# EAGLE schematic TreeShield (EAGLE 6.4)
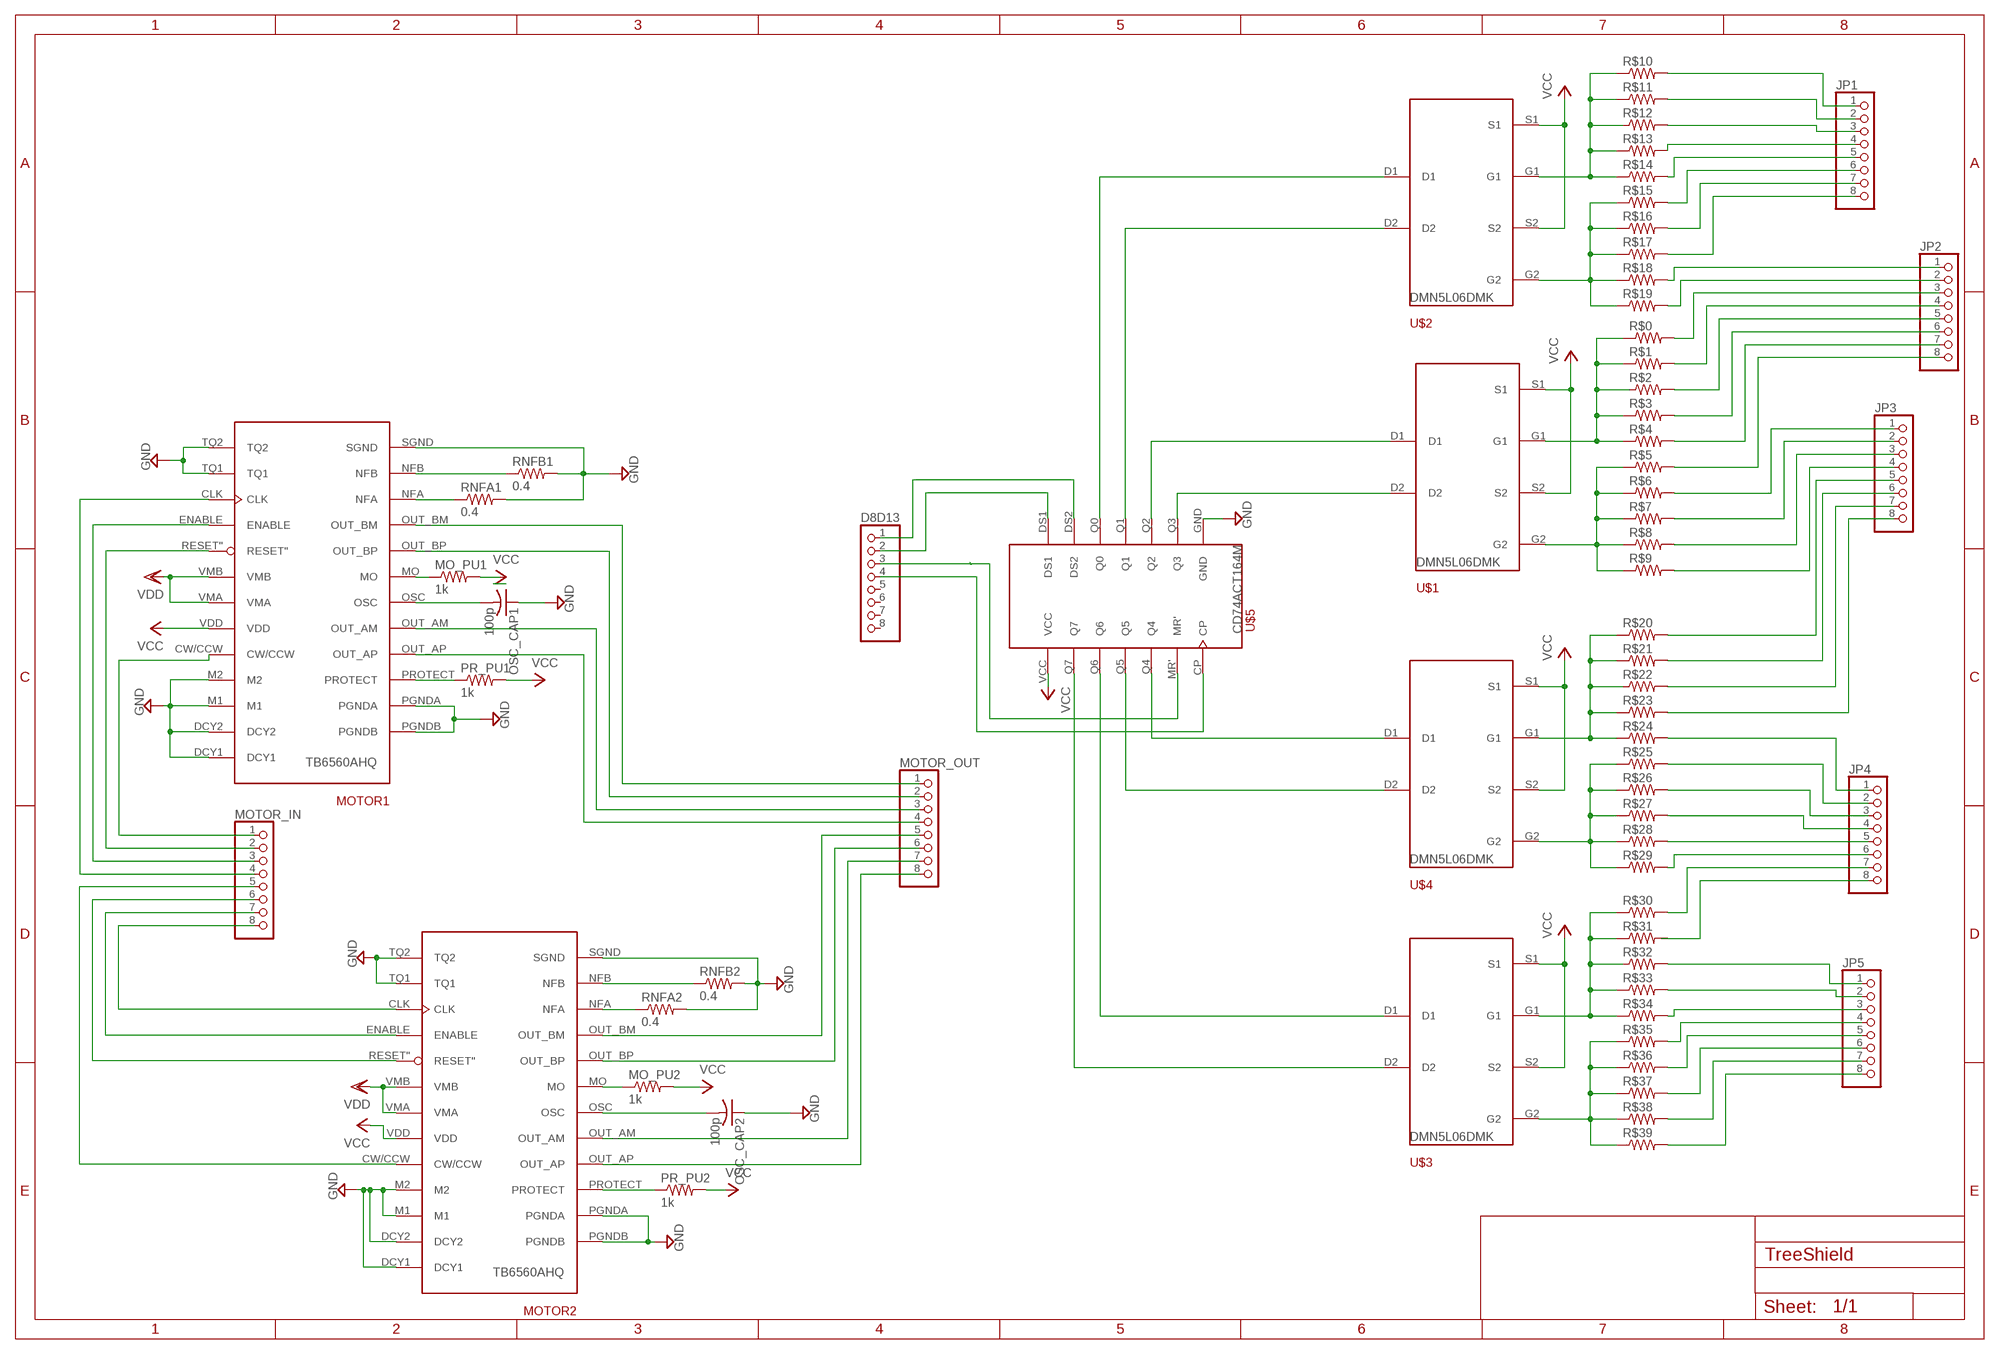
[diagram p0: schematic, sheet 1]

## Parts
D8D13  PINHD-1X8CLEANBIG  [1X08-CLEANBIG]
JP1  PINHD-1X8BIG  [1X08-BIG]
JP2  PINHD-1X8BIG  [1X08-BIG]
JP3  PINHD-1X8BIG  [1X08-BIG]
JP4  PINHD-1X8BIG  [1X08-BIG]
JP5  PINHD-1X8BIG  [1X08-BIG]
MO_PU1  1k  R-US_R0603  [R0603]
MO_PU2  1k  R-US_R0603  [R0603]
MOTOR1  TB6560AHQ  [TB6560AHQ]
MOTOR2  TB6560AHQ  [TB6560AHQ]
MOTOR_IN  PINHD-1X8CLEANBIG  [1X08-CLEANBIG]
MOTOR_OUT  PINHD-1X8CLEANBIG  [1X08-CLEANBIG]
OSC_CAP1  100p  C-USC0603  [C0603]
OSC_CAP2  100p  C-USC0603  [C0603]
PR_PU1  1k  R-US_R0603  [R0603]
PR_PU2  1k  R-US_R0603  [R0603]
R$0  R-US_0817/7V  [P0817V]
R$1  R-US_0817/7V  [P0817V]
R$2  R-US_0817/7V  [P0817V]
R$3  R-US_0817/7V  [P0817V]
R$4  R-US_0817/7V  [P0817V]
R$5  R-US_0817/7V  [P0817V]
R$6  R-US_0817/7V  [P0817V]
R$7  R-US_0817/7V  [P0817V]
R$8  R-US_0817/7V  [P0817V]
R$9  R-US_0817/7V  [P0817V]
R$10  R-US_0817/7V  [P0817V]
R$11  R-US_0817/7V  [P0817V]
R$12  R-US_0817/7V  [P0817V]
R$13  R-US_0817/7V  [P0817V]
R$14  R-US_0817/7V  [P0817V]
R$15  R-US_0817/7V  [P0817V]
R$16  R-US_0817/7V  [P0817V]
R$17  R-US_0817/7V  [P0817V]
R$18  R-US_0817/7V  [P0817V]
R$19  R-US_0817/7V  [P0817V]
R$20  R-US_0817/7V  [P0817V]
R$21  R-US_0817/7V  [P0817V]
R$22  R-US_0817/7V  [P0817V]
R$23  R-US_0817/7V  [P0817V]
R$24  R-US_0817/7V  [P0817V]
R$25  R-US_0817/7V  [P0817V]
R$26  R-US_0817/7V  [P0817V]
R$27  R-US_0817/7V  [P0817V]
R$28  R-US_0817/7V  [P0817V]
R$29  R-US_0817/7V  [P0817V]
R$30  R-US_0817/7V  [P0817V]
R$31  R-US_0817/7V  [P0817V]
R$32  R-US_0817/7V  [P0817V]
R$33  R-US_0817/7V  [P0817V]
R$34  R-US_0817/7V  [P0817V]
R$35  R-US_0817/7V  [P0817V]
R$36  R-US_0817/7V  [P0817V]
R$37  R-US_0817/7V  [P0817V]
R$38  R-US_0817/7V  [P0817V]
R$39  R-US_0817/7V  [P0817V]
RNFA1  0.4  R-US_0817/7V  [P0817V]
RNFA2  0.4  R-US_0817/7V  [P0817V]
RNFB1  0.4  R-US_0817/7V  [P0817V]
RNFB2  0.4  R-US_0817/7V  [P0817V]
U$1  DMN5L06DMK  [DMN5L06DMK]
U$2  DMN5L06DMK  [DMN5L06DMK]
U$3  DMN5L06DMK  [DMN5L06DMK]
U$4  DMN5L06DMK  [DMN5L06DMK]
U$5  CD74ACT164M  [CD74ACT164M]

## Nets
CLK1: MOTOR1.CLK MOTOR_IN.4
CW1: MOTOR1.CW/CCW MOTOR_IN.1
EN1: MOTOR1.ENABLE MOTOR_IN.3
GND: MOTOR1.DCY1 MOTOR1.DCY2 MOTOR1.M1 MOTOR1.M2 MOTOR1.PGNDA MOTOR1.PGNDB MOTOR1.SGND MOTOR1.TQ1 MOTOR1.TQ2 MOTOR2.DCY1 MOTOR2.DCY2 MOTOR2.M1 MOTOR2.M2 MOTOR2.PGNDA MOTOR2.PGNDB MOTOR2.SGND MOTOR2.TQ1 MOTOR2.TQ2 OSC_CAP1.1 OSC_CAP2.1 RNFA1.2 RNFA2.2 RNFB1.2 RNFB2.2 U$5.GND
N$2: U$2.D1 U$5.Q0
N$3: U$2.D2 U$5.Q1
N$4: MOTOR1.NFA RNFA1.1
N$5: MO_PU1.1 MOTOR1.MO
N$6: MOTOR1.PROTECT PR_PU1.1
N$7: MOTOR1.OSC OSC_CAP1.2
N$8: R$0.1 R$1.1 R$3.1 R$4.1 U$1.G1
N$9: R$5.1 R$6.1 R$7.1 R$8.1 R$9.1 U$1.G2
N$10: MOTOR1.NFB RNFB1.1
N$11: MOTOR2.CW/CCW MOTOR_IN.5
N$12: MOTOR2.RESET'' MOTOR_IN.6
N$13: MOTOR2.ENABLE MOTOR_IN.7
N$14: MOTOR2.CLK MOTOR_IN.8
N$15: MOTOR2.NFB RNFB2.1
N$16: MOTOR2.NFA RNFA2.1
N$17: MO_PU2.1 MOTOR2.MO
N$18: MOTOR2.OSC OSC_CAP2.2
N$19: MOTOR2.PROTECT PR_PU2.1
N$20: R$10.1 R$11.1 R$13.1 R$14.1 U$2.G1
N$21: R$15.1 R$16.1 R$17.1 R$18.1 R$19.1 U$2.G2
N$22: R$20.1 R$21.1 R$23.1 R$24.1 U$4.G1
N$23: R$25.1 R$26.1 R$27.1 R$28.1 R$29.1 U$4.G2
N$24: R$30.1 R$31.1 R$33.1 R$34.1 U$3.G1
N$25: R$35.1 R$36.1 R$37.1 R$38.1 R$39.1 U$3.G2
N$26: U$1.D1 U$5.Q2
N$27: U$1.D2 U$5.Q3
N$28: U$4.D1 U$5.Q4
N$29: U$4.D2 U$5.Q5
N$30: U$3.D1 U$5.Q6
N$31: U$3.D2 U$5.Q7
N$32: JP1.1 R$10.2
N$33: JP1.2 R$11.2
N$34: JP1.3 R$12.2
N$35: JP1.4 R$13.2
N$36: JP1.5 R$14.2
N$37: JP1.6 R$15.2
N$38: JP1.7 R$16.2
N$39: JP1.8 R$17.2
N$40: JP2.1 R$18.2
N$41: JP2.2 R$19.2
N$42: JP2.3 R$0.2
N$43: JP2.4 R$1.2
N$44: JP2.5 R$2.2
N$45: JP2.6 R$3.2
N$46: JP2.7 R$4.2
N$47: JP2.8 R$5.2
N$48: JP3.1 R$6.2
N$49: JP3.2 R$7.2
N$50: JP3.3 R$8.2
N$51: JP3.4 R$9.2
N$52: JP3.5 R$20.2
N$53: JP3.6 R$21.2
N$54: JP3.7 R$22.2
N$55: JP3.8 R$23.2
N$56: JP4.1 R$24.2
N$57: JP4.2 R$25.2
N$58: JP4.3 R$26.2
N$59: JP4.4 R$27.2
N$60: JP4.5 R$28.2
N$61: JP4.6 R$29.2
N$62: JP4.7 R$30.2
N$63: JP4.8
N$64: JP5.1 R$32.2
N$65: JP5.2 R$33.2
N$66: JP5.3 R$34.2
N$67: JP5.4 R$35.2
N$68: JP5.5 R$36.2
N$69: JP5.6 R$37.2
N$70: JP5.7 R$38.2
N$71: JP5.8 R$39.2
N$72: D8D13.1 U$5.DS2
N$73: D8D13.2 U$5.DS1
N$74: D8D13.3 U$5.MR'
N$75: D8D13.4 U$5.CP
OUT_AM1: MOTOR1.OUT_AM MOTOR_OUT.3
OUT_AM2: MOTOR2.OUT_AM MOTOR_OUT.7
OUT_AP1: MOTOR1.OUT_AP MOTOR_OUT.4
OUT_AP2: MOTOR2.OUT_AP MOTOR_OUT.8
OUT_BM1: MOTOR1.OUT_BM MOTOR_OUT.1
OUT_BM2: MOTOR2.OUT_BM MOTOR_OUT.5
OUT_BP1: MOTOR1.OUT_BP MOTOR_OUT.2
OUT_BP2: MOTOR2.OUT_BP MOTOR_OUT.6
RESET1: MOTOR1.RESET'' MOTOR_IN.2
VCC: MO_PU1.2 MO_PU2.2 MOTOR1.VDD MOTOR2.VDD PR_PU1.2 PR_PU2.2 U$1.S1 U$1.S2 U$2.S1 U$2.S2 U$3.S1 U$3.S2 U$4.S1 U$4.S2 U$5.VCC
VDD: MOTOR1.VMA MOTOR1.VMB MOTOR2.VMA MOTOR2.VMB
Unconnected: D8D13.5 D8D13.6 D8D13.7 D8D13.8 R$2.1 R$12.1 R$22.1 R$31.2 R$32.1

## Library data of the parts
D8D13 JP1-JP5 MOTOR_IN MOTOR_OUT = adafruit:PINHD-1X8: PIN HEADER
MO_PU1 MO_PU2 PR_PU1 PR_PU2 = adafruit:R-US_: RESISTOR, American symbol
MOTOR1 MOTOR2 = TB6560AHQ:TB6560AHQ
OSC_CAP1 OSC_CAP2 = adafruit:C-US: CAPACITOR, American symbol
R$0 R$1-R$39 RNFA1 RNFA2 RNFB1 RNFB2 = resistor:R-US_: RESISTOR, American symbol
U$1-U$4 = DMN5L06DMK:DMN5L06DMK
U$5 = elecanisms:CD74ACT164M